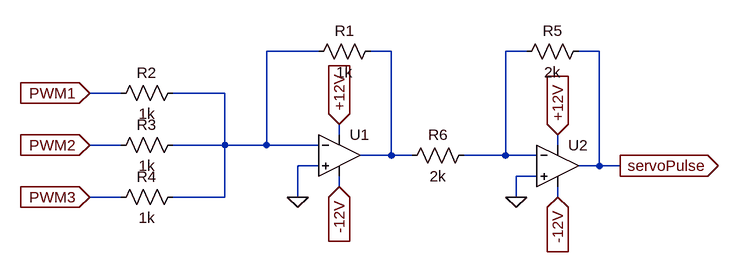
[diagram p0: schematic angle adjustment unit.asc]
angle adjustment unit.asc, the LTspice schematic file:
Version 4
SHEET 1 880 680
WIRE 192 16 112 16
WIRE 304 16 272 16
WIRE 512 16 480 16
WIRE 624 16 592 16
WIRE -112 80 -160 80
WIRE 48 80 -32 80
WIRE 224 144 224 128
WIRE -112 160 -160 160
WIRE 48 160 48 80
WIRE 48 160 -32 160
WIRE 112 160 112 16
WIRE 112 160 48 160
WIRE 192 160 112 160
WIRE 560 160 560 144
WIRE 304 176 304 16
WIRE 304 176 256 176
WIRE 336 176 304 176
WIRE 480 176 480 16
WIRE 480 176 416 176
WIRE 528 176 480 176
WIRE 192 192 160 192
WIRE 624 192 624 16
WIRE 624 192 592 192
WIRE 656 192 624 192
WIRE 528 208 496 208
WIRE 224 224 224 208
WIRE -112 240 -160 240
WIRE 48 240 48 160
WIRE 48 240 -32 240
WIRE 160 240 160 192
WIRE 496 240 496 208
WIRE 560 240 560 224
FLAG 160 240 0
FLAG -160 80 PWM1
IOPIN -160 80 In
FLAG -160 160 PWM2
IOPIN -160 160 In
FLAG -160 240 PWM3
IOPIN -160 240 In
FLAG 496 240 0
FLAG 656 192 servoPulse
IOPIN 656 192 Out
FLAG 224 128 +12V
IOPIN 224 128 In
FLAG 224 224 -12V
IOPIN 224 224 In
FLAG 560 144 +12V
IOPIN 560 144 In
FLAG 560 240 -12V
IOPIN 560 240 In
SYMBOL Opamps\\UniversalOpamp2 224 176 R0
SYMATTR InstName U1
SYMBOL res 288 0 R90
WINDOW 0 0 56 VBottom 2
WINDOW 3 32 56 VTop 2
SYMATTR InstName R1
SYMATTR Value 1k
SYMBOL res -16 64 R90
WINDOW 0 0 56 VBottom 2
WINDOW 3 32 56 VTop 2
SYMATTR InstName R2
SYMATTR Value 1k
SYMBOL res -16 144 R90
WINDOW 0 0 56 VBottom 2
WINDOW 3 32 56 VTop 2
SYMATTR InstName R3
SYMATTR Value 1k
SYMBOL res -16 224 R90
WINDOW 0 0 56 VBottom 2
WINDOW 3 32 56 VTop 2
SYMATTR InstName R4
SYMATTR Value 1k
SYMBOL Opamps\\UniversalOpamp2 560 192 R0
SYMATTR InstName U2
SYMBOL res 608 0 R90
WINDOW 0 0 56 VBottom 2
WINDOW 3 32 56 VTop 2
SYMATTR InstName R5
SYMATTR Value 2k
SYMBOL res 432 160 R90
WINDOW 0 0 56 VBottom 2
WINDOW 3 32 56 VTop 2
SYMATTR InstName R6
SYMATTR Value 2k

The netlist it stands for:
* angle adjustment unit.asc
XU1 0 N001 +12V -12V N002 level.2 Avol=1Meg GBW=10Meg Slew=10Meg ilimit=25m rail=0 Vos=0 phimargin=45 en=0 enk=0 in=0 ink=0 Rin=500Meg  ; pins IN+ IN- V+ V- OUT
R1 N002 N001 1k
R2 N001 PWM1 1k
R3 N001 PWM2 1k
R4 N001 PWM3 1k
XU2 0 N003 +12V -12V servoPulse level.2 Avol=1Meg GBW=10Meg Slew=10Meg ilimit=25m rail=0 Vos=0 phimargin=45 en=0 enk=0 in=0 ink=0 Rin=500Meg  ; pins IN+ IN- V+ V- OUT
R5 servoPulse N003 2k
R6 N003 N002 2k
.lib UniversalOpamps2.sub
.backanno
.end